# EAGLE design M310A (EAGLE 6.6.0)
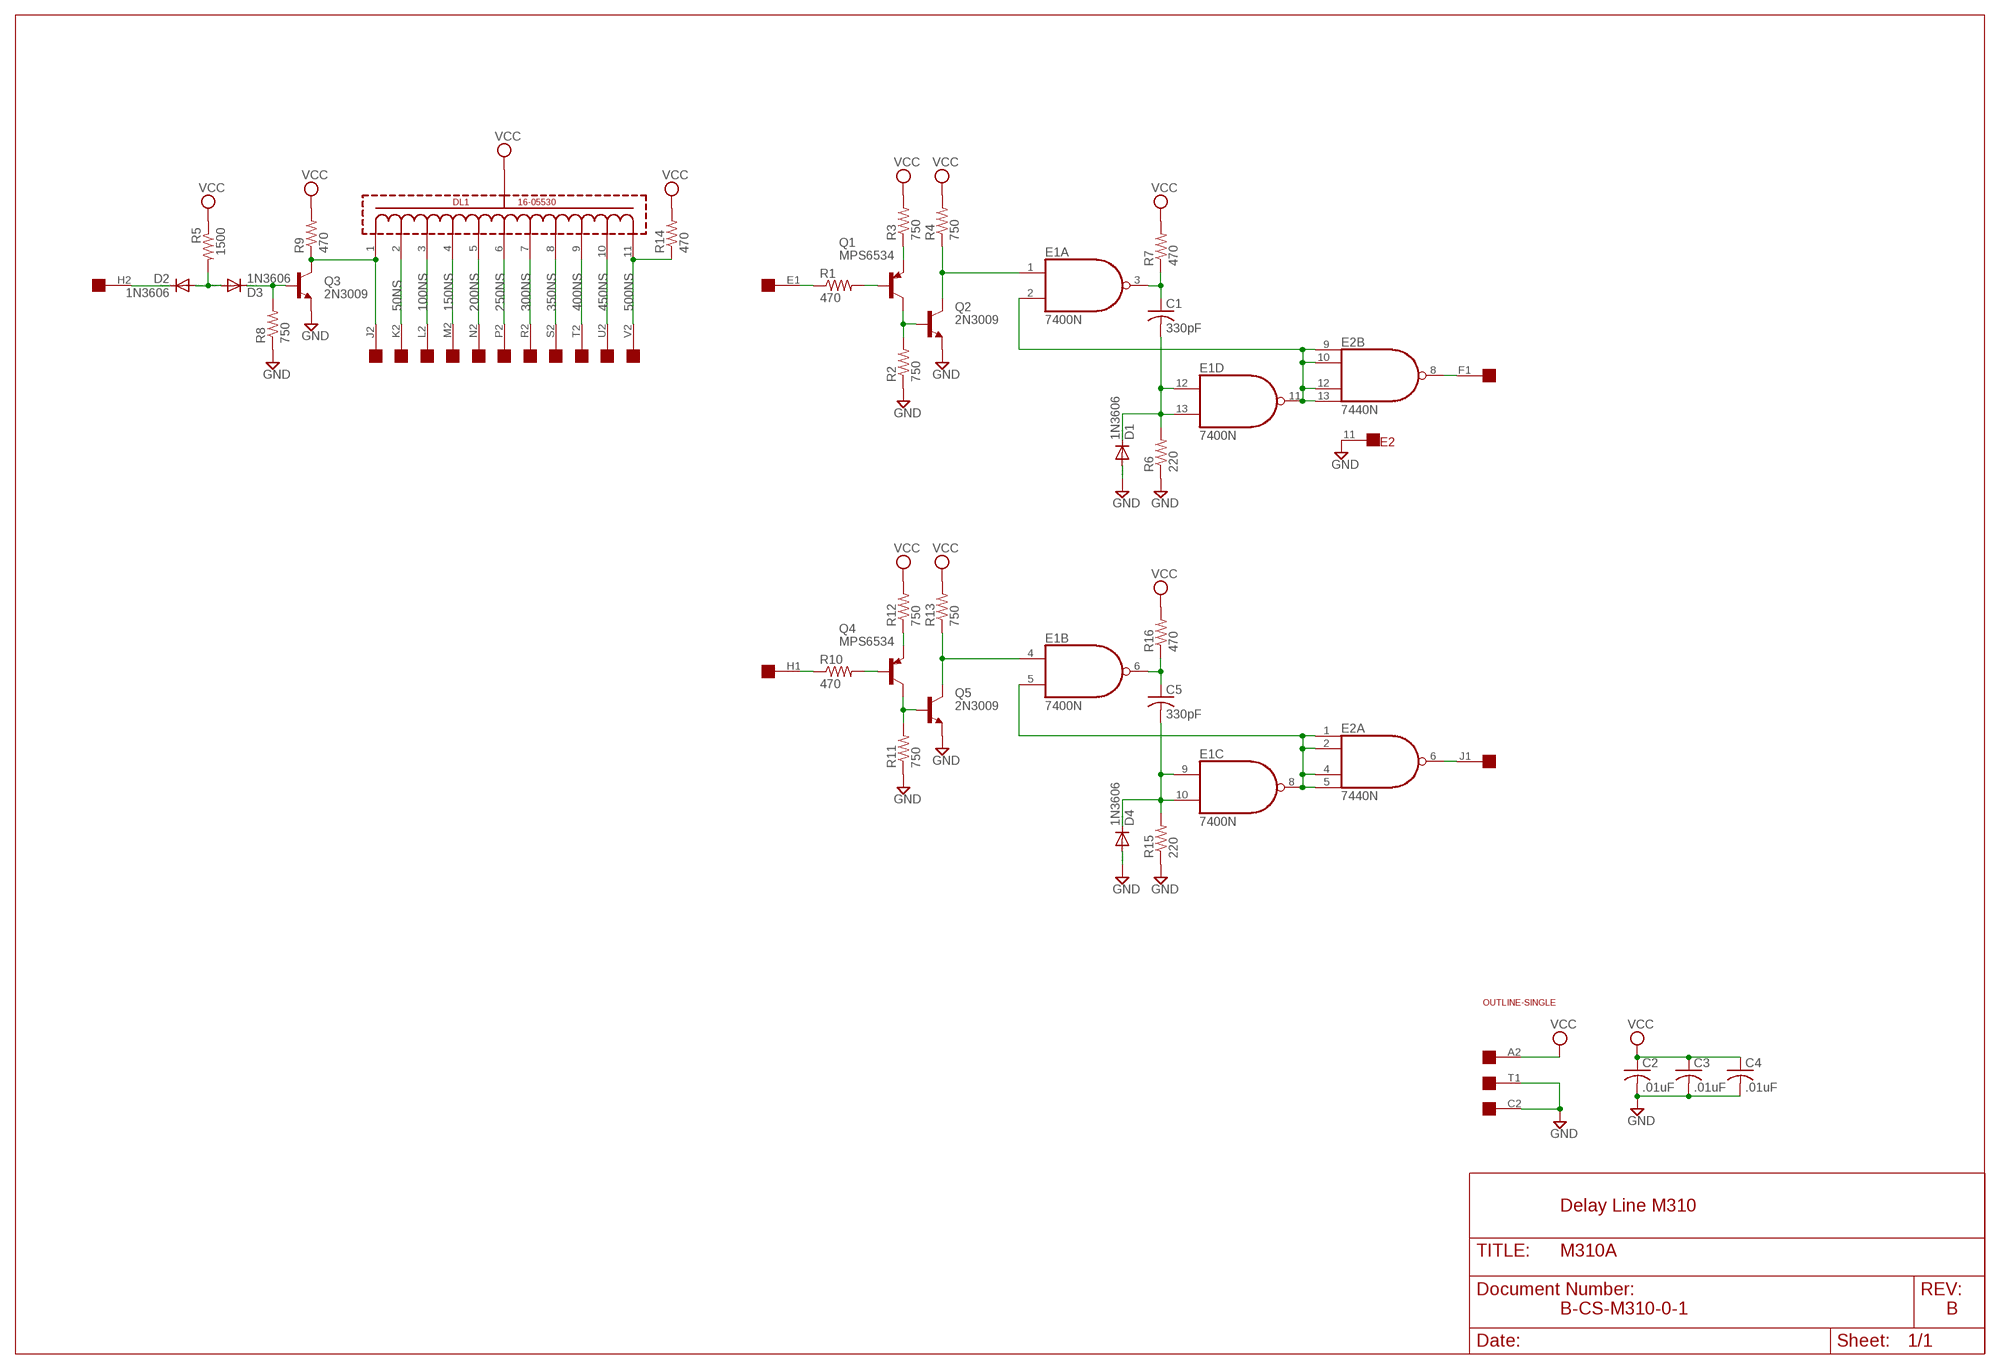
[diagram p0: schematic, sheet 1]

## Parts
C1  330pF  C-US050-025X075  [C050-025X075]
C2  .01uF  C-US050-025X075  [C050-025X075]
C3  .01uF  C-US050-025X075  [C050-025X075]
C4  .01uF  C-US050-025X075  [C050-025X075]
C5  330pF  C-US050-025X075  [C050-025X075]
D1  1N3606  1N4148DO35-10  [DO35-10]
D2  1N3606  1N4148DO35-10  [DO35-10]
D3  1N3606  1N4148DO35-10  [DO35-10]
D4  1N3606  1N4148DO35-10  [DO35-10]
DL1  16-05530  [16-05530]
E1  7400N  [DIL14]
E2  7440N  74S20N  [DIL14]
Q1  MPS6534  2N3637  [TO39]
Q2  2N3009  2N3019-NPN-TO39-EBC  [TO39]
Q3  2N3009  2N3019-NPN-TO39-EBC  [TO39]
Q4  MPS6534  2N3637  [TO39]
Q5  2N3009  2N3019-NPN-TO39-EBC  [TO39]
R1  470  R-US_0207/10  [0207/10]
R2  750  R-US_0207/10  [0207/10]
R3  750  R-US_0207/10  [0207/10]
R4  750  R-US_0207/10  [0207/10]
R5  1500  R-US_0207/10  [0207/10]
R6  220  R-US_0207/10  [0207/10]
R7  470  R-US_0207/10  [0207/10]
R8  750  R-US_0207/10  [0207/10]
R9  470  R-US_0207/10  [0207/10]
R10  470  R-US_0207/10  [0207/10]
R11  750  R-US_0207/10  [0207/10]
R12  750  R-US_0207/10  [0207/10]
R13  750  R-US_0207/10  [0207/10]
R14  470  R-US_0207/10  [0207/10]
R15  220  R-US_0207/10  [0207/10]
R16  470  R-US_0207/10  [0207/10]
U$1  OUTLINE-SINGLE  [SINGLE]
U$4  SINGLE  [EDGE-CON2]

## Nets
50NS: DL1.2 U$4.K2
100NS: DL1.3 U$4.L2
150NS: DL1.4 U$4.M2
200NS: DL1.5 U$4.N2
250NS: DL1.6 U$4.P2
300NS: DL1.7 U$4.R2
350NS: DL1.8 U$4.S2
400NS: DL1.9 U$4.T2
450NS: DL1.10 U$4.U2
500NS: DL1.11 R14.1 U$4.V2
GND [power]: C2.2 C3.2 C4.2 D1.A D4.A E2.11(11:NC) Q2.1(E) Q3.1(E) Q5.1(E) R2.1 R6.1 R8.1 R11.1 R15.1 U$4.C2 U$4.T1
N$1: C1.2 D1.C E1.12(D:I0) E1.13(D:I1) R6.2
N$2: D2.C U$4.H2
N$3: D2.A D3.A R5.2
N$4: C1.1 E1.3(A:O) R7.1
N$5: D3.C Q3.2(B) R8.2
N$6: R1.1 U$4.E1
N$7: Q1.2(B) R1.2
N$8: Q1.1(E) R3.1
N$9: Q1.3(C) Q2.2(B) R2.2
N$10: E1.1(A:I0) Q2.3(C) R4.1
N$11: E1.2(A:I1) E1.11(D:O) E2.9(B:I0) E2.10(B:I1) E2.12(B:I2) E2.13(B:I3)
N$12: E2.8(B:O) U$4.F1
N$13: C5.2 D4.C E1.9(C:I0) E1.10(C:I1) R15.2
N$14: R10.1 U$4.H1
N$15: Q4.2(B) R10.2
N$16: Q4.1(E) R12.1
N$17: Q4.3(C) Q5.2(B) R11.2
N$18: E1.4(B:I0) Q5.3(C) R13.1
N$19: C5.1 E1.6(B:O) R16.1
N$20: E1.5(B:I1) E1.8(C:O) E2.1(A:I0) E2.2(A:I1) E2.4(A:I2) E2.5(A:I3)
N$21: E2.6(A:O) U$4.J1
N$23: DL1.1 Q3.3(C) R9.1 U$4.J2
VCC [power]: C2.1 C3.1 C4.1 DL1.12(GND) R3.2 R4.2 R5.1 R7.2 R9.2 R12.2 R13.2 R14.2 R16.2 U$4.A2
Unconnected: E2.3(3:NC) U$4.A1 U$4.B1 U$4.B2 U$4.C1 U$4.D1 U$4.D2 U$4.E2 U$4.F2 U$4.K1 U$4.L1 U$4.M1 U$4.N1 U$4.P1 U$4.R1 U$4.S1 U$4.U1 U$4.V1

## Notes on the sheet
- Delay Line M310
- B-CS-M310-0-1 | B

## Power pins joined to a net without a drawn wire
GND: E1.7(P:GND) E2.7(P:GND)
VCC: E1.14(P:VCC) E2.14(P:VCC)

## Library data of the parts
C1-C5 = rcl:C-US: CAPACITOR, American symbol
D1-D4 = diode:1N4148: DIODE high speed (Philips)
DL1 = dec-con:16-05530: Delay Line (M310 style)
E1 = 74xx-us:74*00: Quad 2-input NAND gate
E2 = dec-con:74*20: Dual 4-input NAND gate
Q1 Q4 = transistor-pnp:2N3637*: PNP Transistror
Q2 Q3 Q5 = transistor:*-NPN-: NPN Transistror BF959 corrected 2008.03.06
R1-R16 = rcl:R-US_: RESISTOR, American symbol
U$1 = dec-con:OUTLINE-*: Board outlines for DEC boards.
U$4 = dec-con:SINGLE: Single-Height DEC board

## Net classes
1 power: width 0.813 mm

## Board
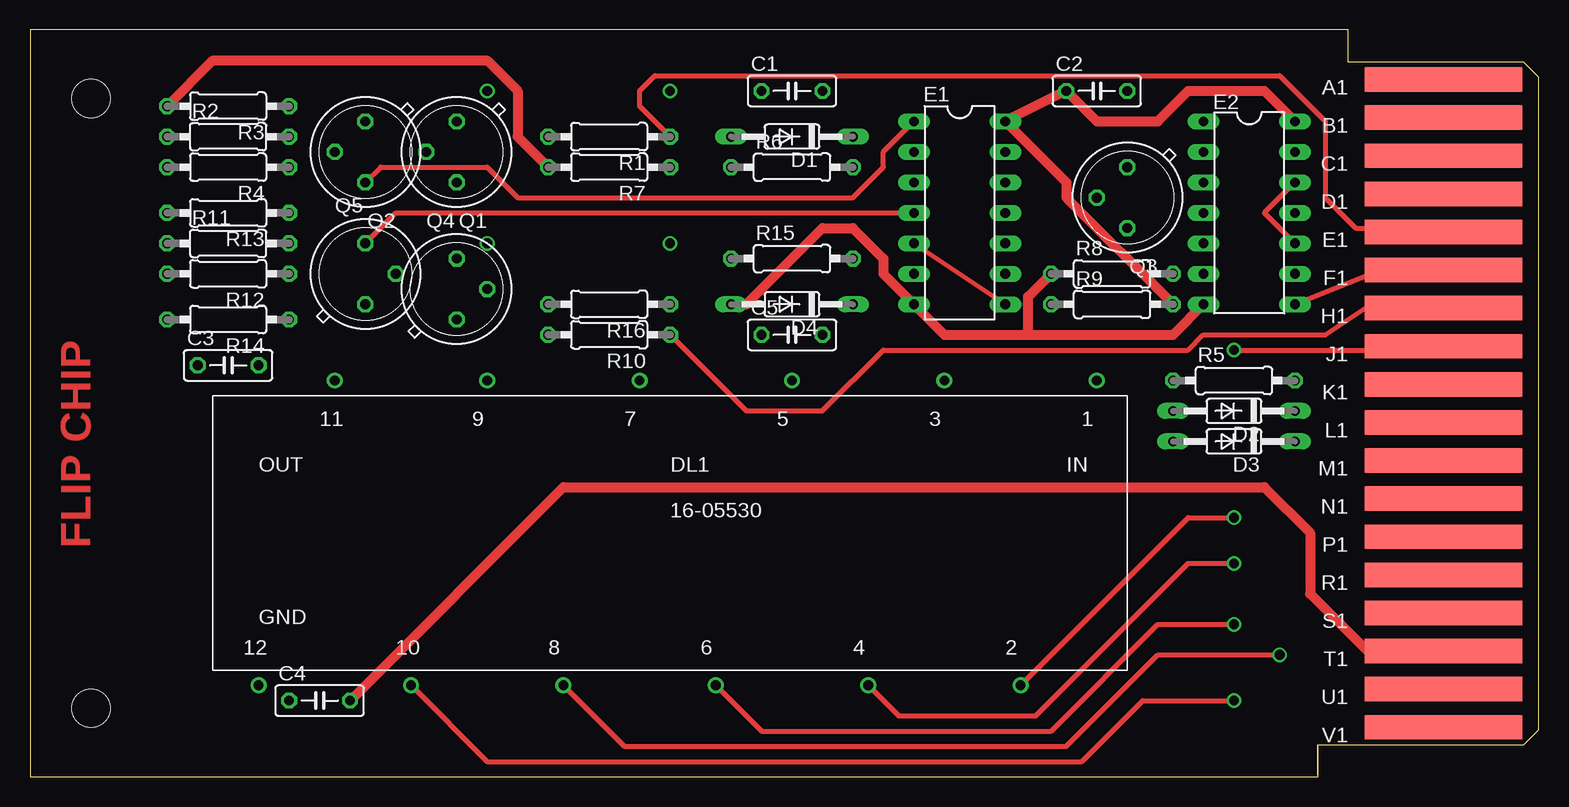
[diagram p1: board, top side]
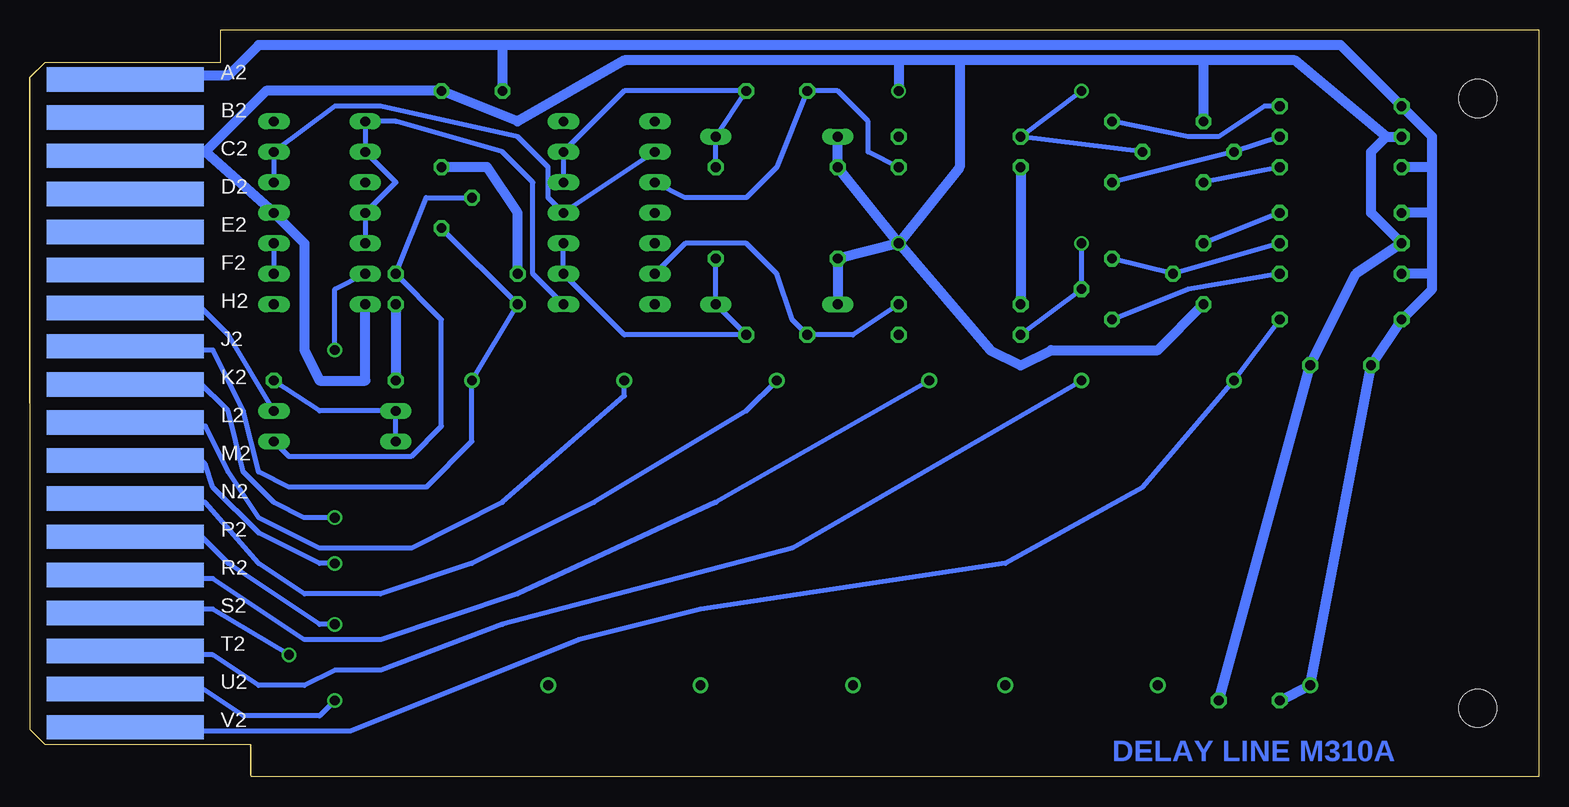
[diagram p2: board, bottom side, seen from below]

Size 125.73 x 62.23 mm. Coordinates in mm from the lower left corner, seen from the top.
Copper layers (1+16): Top 0.035mm / dielectric 1.5mm / Bottom 0.035mm
Design rules "16mils": minimum track width 16mil, minimum drill 32mil, track to track 15mil, track to pad 10mil, pad to pad 10mil, via to via 10mil, smd to smd 10mil, copper to edge 13mil, drill to drill 10mil, minimum pad ring 10mil, minimum via ring 8mil, stop-mask expansion 0mil, vias tented up to drill 0mil, thermal gap 10mil

### Footprints (pad centres in the part's own frame; a part is rotated, then mirrored left to right if it is on the bottom)
C050-025X075 = drill 0.813 octagon: 1 -2.54,0; 2 2.54,0
DO35-10 = drill 0.813 long: A 5.08,0; C -5.08,0
16-05530 = drill 0.813: 1 35.56,12.7; 2 29.21,-12.7; 3 22.86,12.7; 4 16.51,-12.7; 5 10.16,12.7; 6 3.81,-12.7; 7 -2.54,12.7; 8 -8.89,-12.7; 9 -15.24,12.7; 10 -21.59,-12.7; 11 -27.94,12.7; 12 -34.29,-12.7
DIL14 = drill 0.813 long: 1 -7.62,-3.81; 2 -5.08,-3.81; 3 -2.54,-3.81; 4 0,-3.81; 5 2.54,-3.81; 6 5.08,-3.81; 7 7.62,-3.81; 8 7.62,3.81; 9 5.08,3.81; 10 2.54,3.81; 11 0,3.81; 12 -2.54,3.81; 13 -5.08,3.81; 14 -7.62,3.81
TO39 = drill 0.813 octagon: 1 0,-2.54; 2 2.54,0; 3 0,2.54
0207/10 = drill 0.813 octagon: 1 -5.08,0; 2 5.08,0
SINGLE = hole 3.175: 120.65,56.515; 120.65,5.715
EDGE-CON2 = smd 13.106 x 2.032: A1 7.938,4.128; B1 7.938,7.303; C1 7.938,10.477; D1 7.938,13.652; E1 7.938,16.828; F1 7.938,20.003; H1 7.938,23.177; J1 7.938,26.352; K1 7.938,29.527; L1 7.938,32.703; M1 7.938,35.877; N1 7.938,39.053; P1 7.938,42.227; R1 7.938,45.403; S1 7.938,48.578; T1 7.938,51.752; U1 7.938,54.928; V1 7.938,58.102 | smd 13.106 x 2.032 bottom: A2 7.938,4.128; B2 7.938,7.303; C2 7.938,10.477; D2 7.938,13.652; E2 7.938,16.828; F2 7.938,20.003; H2 7.938,23.177; J2 7.938,26.352; K2 7.938,29.527; L2 7.938,32.703; M2 7.938,35.877; N2 7.938,39.053; P2 7.938,42.227; R2 7.938,45.403; S2 7.938,48.578; T2 7.938,51.752; U2 7.938,54.928; V2 7.938,58.102

### Placement (x,y rotation side)
C1  63.5,57.15 0 top
C2  88.9,57.15 0 top
C3  16.51,34.29 0 top
C4  24.13,6.35 0 top
C5  63.5,36.83 0 top
D1  63.5,53.34 180 top
D2  100.33,30.48 180 top
D3  100.33,27.94 180 top
D4  63.5,39.37 180 top
DL1  53.34,20.32 0 top
E1  77.47,46.99 270 top
E2  101.6,46.99 270 top
Q1  35.56,52.07 180 top
Q2  27.94,52.07 180 top
Q3  91.44,48.26 180 top
Q4  35.56,40.64 0 top
Q5  27.94,41.91 0 top
R1  48.26,53.34 180 top
R2  16.51,53.34 0 top
R3  16.51,55.88 180 top
R4  16.51,50.8 180 top
R5  100.33,33.02 0 top
R6  63.5,50.8 0 top
R7  48.26,50.8 180 top
R8  90.17,41.91 0 top
R9  90.17,39.37 0 top
R10  48.26,36.83 180 top
R11  16.51,44.45 0 top
R12  16.51,41.91 180 top
R13  16.51,46.99 180 top
R14  16.51,38.1 180 top
R15  63.5,43.18 0 top
R16  48.26,39.37 180 top
U$1  125.73,62.23 180 top
U$3  [FLIPCHIP]  0,0 0 top
U$4  125.73,62.23 180 top

### Tracks (layer width: path | path; a pad name or v marks a point on that pad's centre or on a via)
50NS  (via drill 0.81)
  Top 0.406: v100.33,21.59 96.52,21.59 DL1.2
  Bottom 0.406: U$4.K2 116.84,33.02 111.76,33.02 109.22,30.48 107.95,25.4 105.41,22.86 102.87,21.59 v100.33,21.59
100NS
  Bottom 0.406: DL1.3 76.2,31.75 86.36,22.86 93.98,19.05 101.6,19.05 106.68,21.59 109.22,25.4 111.12,29.21 116.84,29.21 U$4.L2
150NS  (via drill 0.81)
  Top 0.406: v100.33,17.78 96.52,17.78 83.82,5.08 72.39,5.08 DL1.4
  Bottom 0.406: U$4.M2 116.84,26.67 111.76,26.67 111.12,26.04 110.49,24.13 106.68,20.32 101.6,17.78 v100.33,17.78
200NS
  Bottom 0.406: DL1.5 66.04,30.48 78.74,22.86 88.9,17.78 96.52,15.24 102.87,15.24 106.68,17.78 111.12,22.86 116.84,22.86 U$4.N2
250NS  (via drill 0.81)
  Top 0.406: v100.33,12.7 93.98,12.7 85.09,3.81 60.96,3.81 DL1.6
  Bottom 0.406: U$4.P2 116.84,20.32 111.76,20.32 109.22,17.78 101.6,12.7 v100.33,12.7
300NS
  Bottom 0.406: DL1.7 68.58,22.86 85.09,15.24 96.52,11.43 102.87,11.43 110.49,16.51 116.84,16.51 U$4.R2
350NS  (via drill 0.81)
  Top 0.406: v104.14,10.16 93.98,10.16 86.36,2.54 49.53,2.54 DL1.8
  Bottom 0.406: U$4.S2 116.84,13.97 110.49,13.97 v104.14,10.16
400NS
  Bottom 0.406: DL1.9 62.23,19.05 86.36,12.7 96.52,8.89 100.33,8.89 102.87,7.62 106.68,7.62 110.49,10.16 116.84,10.16 U$4.T2
450NS  (via drill 0.81)
  Top 0.406: v100.33,6.35 92.71,6.35 87.63,1.27 38.1,1.27 DL1.10
  Bottom 0.406: U$4.U2 116.84,7.62 111.76,7.62 107.95,5.08 101.6,5.08 v100.33,6.35
500NS
  Bottom 0.406: R14.1 DL1.11 33.02,24.13 44.45,17.78 69.85,13.97 80.01,11.43 99.06,3.81 116.84,3.81 U$4.V2
GND  (via drill 0.81)
  Top 0.813: D4.A 59.69,39.37 66.04,45.72 68.58,45.72 71.12,43.18 71.12,41.91 E1.7 76.2,36.83 83.19,36.83 | E2.7 95.25,36.83 83.19,36.83 | R8.1 83.19,40.01 83.19,36.83 | U$4.T1 116.84,10.16 111.76,10.16 106.68,15.24 106.68,20.32 102.87,24.13 44.45,24.13 C4.2
  Bottom 0.813: Q3.1 87.63,50.8 85.09,46.99 R8.1 | U$4.C2 116.84,52.07 111.12,52.07 | 111.12,52.07 E2.11 102.87,44.45 102.87,35.56 101.6,33.02 97.79,33.02 E2.7 | 111.12,52.07 106.05,57.15 C2.2 85.09,54.61 76.2,59.69 53.34,59.69 | D1.A R6.1 v53.34,44.45 | D4.A R15.1 v53.34,44.45 | Q5.1 31.75,35.56 40.64,35.56 43.18,34.29 45.72,35.56 v53.34,44.45 | v53.34,44.45 48.26,50.8 48.26,59.69 | 48.26,59.69 53.34,59.69 | 12.7,53.34 R2.1 | 12.7,53.34 20.32,59.69 27.94,59.69 | 27.94,59.69 48.26,59.69 | 27.94,59.69 Q2.1 | 12.7,53.34 13.97,52.07 13.97,46.99 R11.1 15.24,41.91 C3.2 C4.2 | 53.34,59.69 v53.34,57.15
N$1
  Bottom 0.406: R6.2 D1.C C1.2 76.2,57.15 E1.13 E1.12
N$2
  Bottom 0.406: U$4.H2 116.84,39.37 111.76,39.37 109.22,36.83 D2.C
N$3
  Bottom 0.406: R5.2 101.6,30.48 D2.A D3.A
N$4
  Bottom 0.406: R7.1 55.88,52.07 55.88,54.61 58.42,57.15 C1.1 63.5,50.8 66.04,48.26 71.12,48.26 E1.3
N$5
  Bottom 0.406: D3.C 104.14,26.67 93.98,26.67 91.44,29.21 91.44,38.1 R8.2 92.71,48.26 Q3.2
N$6
  Top 0.406: R1.1 50.8,55.88 50.8,57.15 52.07,58.42 104.14,58.42 107.95,54.61 107.95,49.53 107.95,48.26 110.49,45.72 111.76,45.72 116.84,45.72 U$4.E1
N$7  (via drill 0.81)
  Bottom 0.406: Q1.2 R1.2 v38.1,57.15
N$8
  Bottom 0.406: R3.1 22.86,55.88 26.67,53.34 29.21,53.34 Q1.1
N$9
  Bottom 0.406: R2.2 Q2.2 Q1.3
N$10
  Top 0.406: E1.1 71.12,52.07 71.12,50.8 68.58,48.26 40.64,48.26 38.1,50.8 29.21,50.8 Q2.3
  Bottom 0.406: R4.1 Q2.3
N$11
  Top 0.406: E2.10 102.87,46.99 E2.12
  Bottom 0.406: E1.2 E1.11 82.55,48.26 82.55,50.8 85.09,53.34 96.52,55.88 100.33,55.88 E2.13 E2.12 | E2.10 E2.9
N$12
  Top 0.406: U$4.F1 116.84,41.91 111.76,41.91 E2.8
N$13
  Bottom 0.406: E1.10 E1.9 76.2,36.83 C5.2 D4.C R15.2
N$14
  Top 0.406: U$4.H1 116.84,39.37 111.76,39.37 107.95,36.83 97.79,36.83 96.52,35.56 71.12,35.56 66.04,30.48 59.69,30.48 R10.1
N$15  (via drill 0.81)
  Bottom 0.406: R10.2 Q4.2 v38.1,44.45
N$16
  Bottom 0.406: R12.1 29.21,40.64 Q4.1
N$17
  Bottom 0.406: R11.2 Q5.2 Q4.3
N$18
  Top 0.406: Q5.3 30.48,46.99 E1.4
  Bottom 0.406: R13.1 Q5.3
N$19
  Bottom 0.406: E1.6 71.12,44.45 66.04,44.45 63.5,41.91 62.23,38.1 C5.1 57.15,36.83 R16.1
N$20
  Top 0.406: E1.5 E1.8
  Bottom 0.406: E1.8 83.82,41.91 83.82,49.53 86.36,52.07 95.25,54.61 E2.1 E2.2 95.25,49.53 E2.4 E2.5
N$21  (via drill 0.81)
  Top 0.406: U$4.J1 116.84,35.56 v100.33,35.56
  Bottom 0.406: E2.6 100.33,40.64 v100.33,35.56
N$23
  Bottom 0.406: Q3.3 R9.1 DL1.1 88.9,27.94 92.71,24.13 104.14,24.13 106.68,25.4 107.95,30.48 110.49,35.56 111.76,35.56 116.84,35.56 U$4.J2
VCC
  Top 0.813: R9.2 86.36,48.26 86.36,49.53 E1.14 C2.1 88.9,54.61 93.98,54.61 96.52,57.15 102.87,57.15 E2.14 | R7.2 40.64,53.34 40.64,57.15 38.1,59.69 15.24,59.69 R3.2
  Bottom 0.813: U$4.A2 116.84,58.42 109.22,58.42 106.68,60.96 86.36,60.96 | 86.36,60.96 C2.1 | 86.36,60.96 16.51,60.96 R3.2 8.89,53.34 8.89,50.8 | C4.1 DL1.12 C3.1 R14.2 8.89,40.64 8.89,41.91 | 8.89,41.91 8.89,46.99 | 8.89,46.99 8.89,50.8 | 8.89,50.8 R4.2 | 8.89,41.91 R12.2 | 8.89,46.99 R13.2 | R7.2 R16.2 | R9.2 R5.1

### Text on the board
Bottom: DELAY LINE M310A